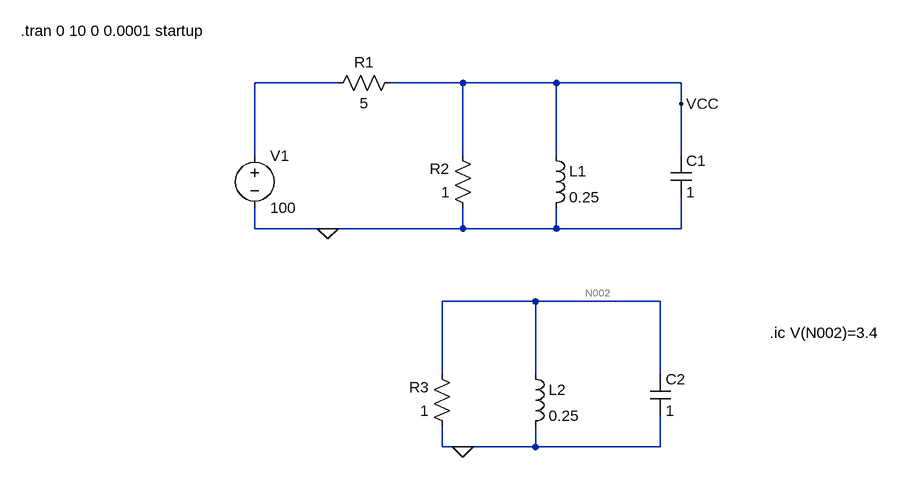
[diagram p0: schematic Q8_8.asc]
Q8_8.asc, the LTspice schematic file:
Version 4
SHEET 1 1044 680
WIRE 192 0 64 0
WIRE 384 0 272 0
WIRE 528 0 384 0
WIRE 720 0 528 0
WIRE 720 32 720 0
WIRE 64 112 64 0
WIRE 384 112 384 0
WIRE 528 112 528 0
WIRE 720 112 720 32
WIRE 64 224 64 192
WIRE 176 224 64 224
WIRE 384 224 384 192
WIRE 384 224 176 224
WIRE 528 224 528 192
WIRE 528 224 384 224
WIRE 720 224 720 176
WIRE 720 224 528 224
WIRE 496 336 352 336
WIRE 688 336 496 336
WIRE 352 448 352 336
WIRE 496 448 496 336
WIRE 688 448 688 336
WIRE 352 560 352 528
WIRE 384 560 352 560
WIRE 496 560 496 528
WIRE 496 560 384 560
WIRE 688 560 688 512
WIRE 688 560 496 560
FLAG 176 224 0
FLAG 720 32 VCC
FLAG 384 560 0
SYMBOL voltage 64 96 R0
WINDOW 123 0 0 Left 0
WINDOW 39 0 0 Left 0
SYMATTR InstName V1
SYMATTR Value 100
SYMBOL res 288 -16 R90
WINDOW 0 0 56 VBottom 2
WINDOW 3 32 56 VTop 2
SYMATTR InstName R1
SYMATTR Value 5
SYMBOL res 400 208 R180
WINDOW 0 36 76 Left 2
WINDOW 3 36 40 Left 2
SYMATTR InstName R2
SYMATTR Value 1
SYMBOL ind 512 96 R0
SYMATTR InstName L1
SYMATTR Value 0.25
SYMBOL cap 704 112 R0
SYMATTR InstName C1
SYMATTR Value 1
SYMBOL res 368 544 R180
WINDOW 0 36 76 Left 2
WINDOW 3 36 40 Left 2
SYMATTR InstName R3
SYMATTR Value 1
SYMBOL ind 480 432 R0
SYMATTR InstName L2
SYMATTR Value 0.25
SYMBOL cap 672 448 R0
SYMATTR InstName C2
SYMATTR Value 1
TEXT -296 -80 Left 2 !.tran 0 10 0 0.0001 startup
TEXT 856 384 Left 2 !.ic V(N002)=3.4

The netlist it stands for:
* Q8_8.asc
V1 N001 0 100
R1 VCC N001 5
R2 0 VCC 1
L1 VCC 0 0.25
C1 VCC 0 1
R3 0 N002 1
L2 N002 0 0.25
C2 N002 0 1
.tran 0 10 0 0.0001 startup
.ic V(N002)=3.4
.backanno
.end